# EAGLE design Mag_Read_STM_IN (EAGLE 6.6.0)

## Sheet 1 of 3
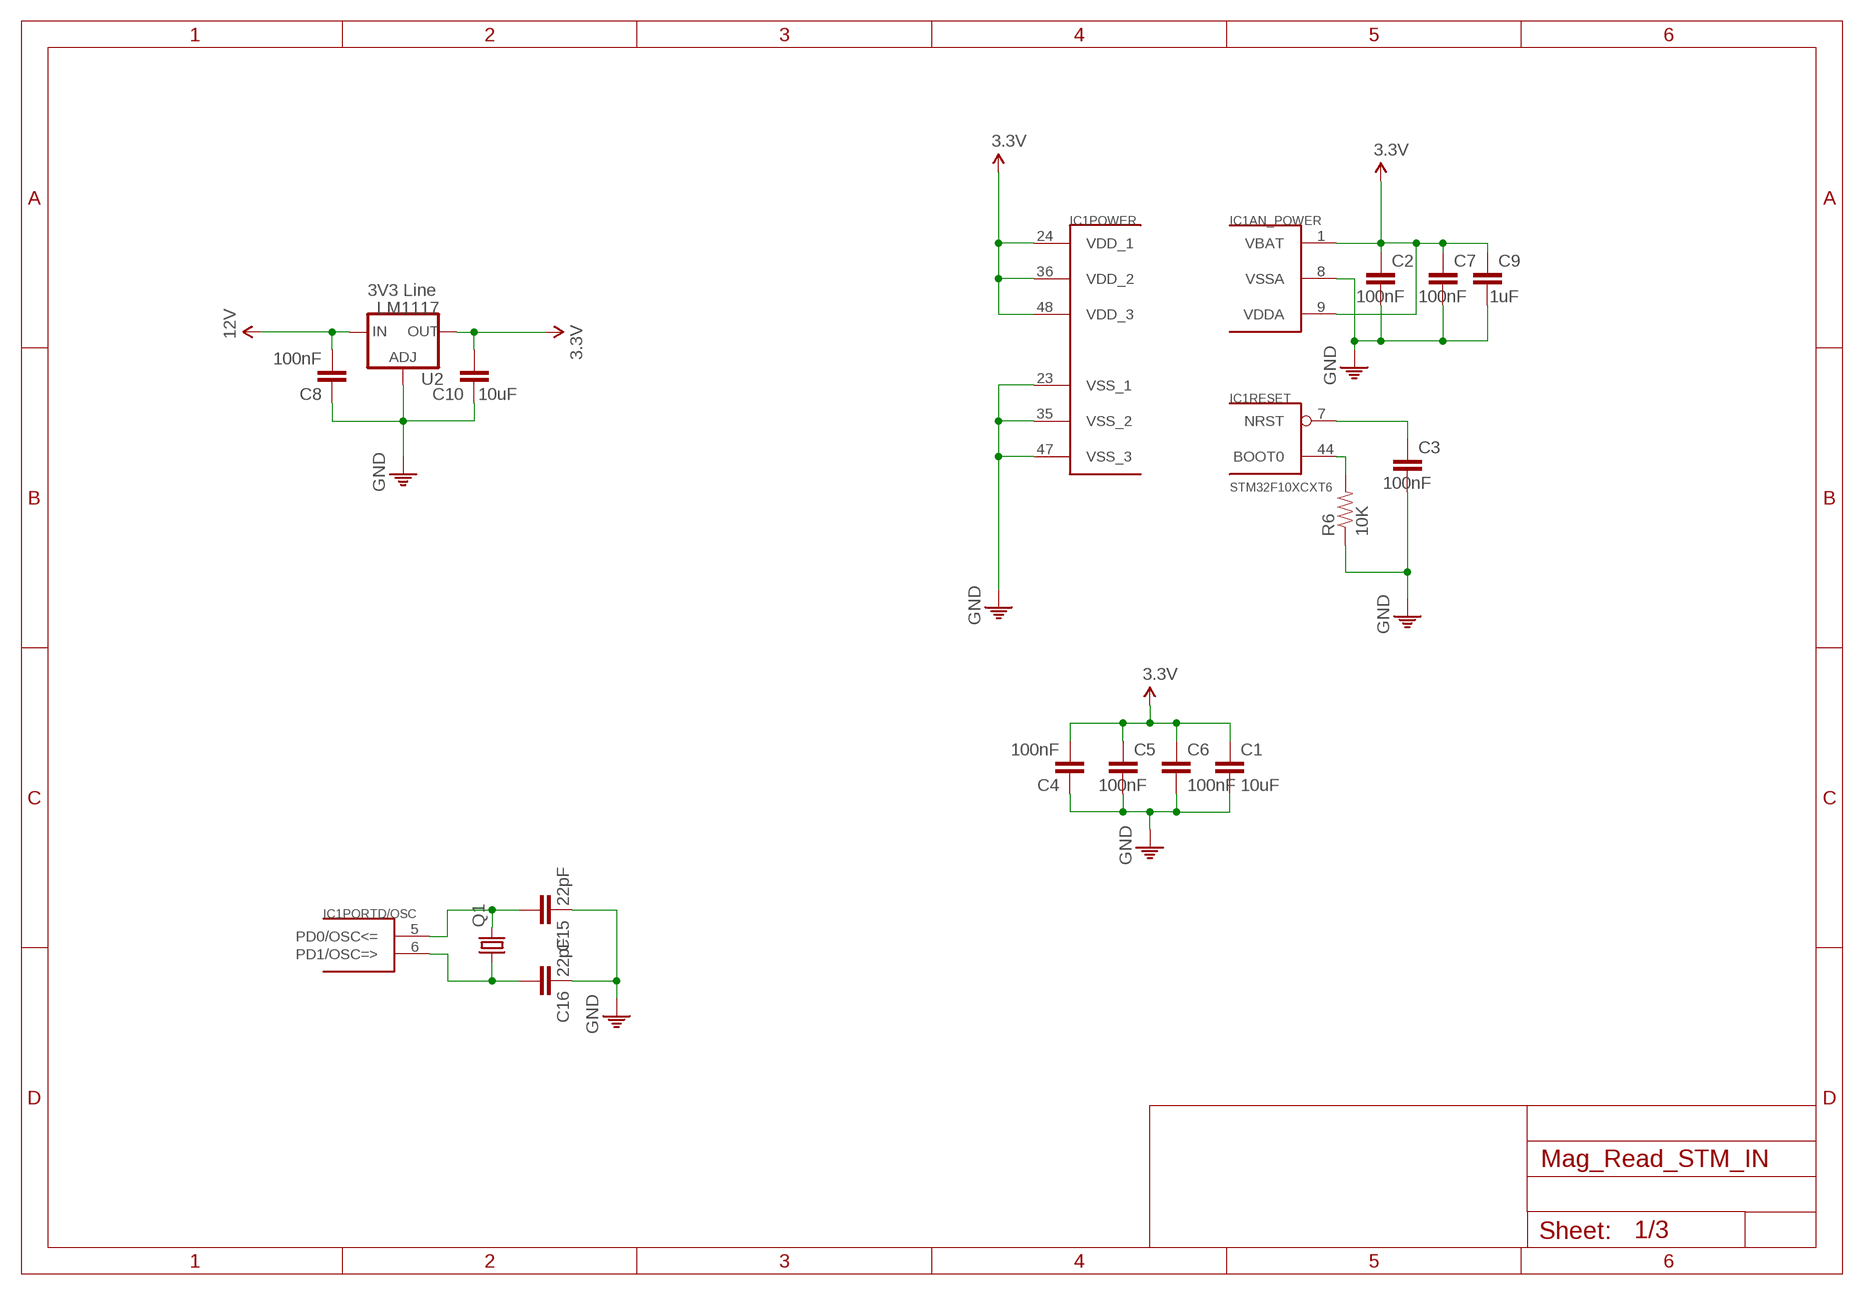
[diagram p0: schematic, sheet 1]

### Parts
C1  10uF  C-EUC0603  [C0603]
C2  100nF  C-EUC0603  [C0603]
C3  100nF  C-EUC0603  [C0603]
C4  100nF  C-EUC0603  [C0603]
C5  100nF  C-EUC0603  [C0603]
C6  100nF  C-EUC0603  [C0603]
C7  100nF  C-EUC0603  [C0603]
C8  100nF  C-EUC0603  [C0603]
C9  1uF  C-EUC0603  [C0603]
C10  10uF  C-EUC0603  [C0603]
C15  22pF  C-EUC0603  [C0603]
C16  22pF  C-EUC0603  [C0603]
IC1  STM32F10XCXT6  [TQFP48]
Q1  CRYSTALCTS406  [CTS406]
R6  10K  RESISTOR0603-RES  [0603-RES]
U2  LM1117  V_REG_317SMD  [SOT223]

### Nets
3.3V: C1.1 C2.1 C4.2 C5.1 C6.1 C7.1 C9.1 C10.2 IC1.1(AN_POWER:VBAT) IC1.9(AN_POWER:VDDA) IC1.24(POWER:VDD_1) IC1.36(POWER:VDD_2) IC1.48(POWER:VDD_3) U2.2(OUT) U2.4(OUT) ; also sheet 2,3
12V: C8.2 U2.3(IN) ; also sheet 3
GND: C1.2 C2.2 C3.2 C4.1 C5.2 C6.2 C7.2 C8.1 C9.2 C10.1 C15.1 C16.1 IC1.8(AN_POWER:VSSA) IC1.23(POWER:VSS_1) IC1.35(POWER:VSS_2) IC1.47(POWER:VSS_3) R6.1 U2.1(ADJ) ; also sheet 2,3
N$1: C15.2 IC1.5(PORTD/OSC:PD0/OSC<=) Q1.3
N$4: C16.2 IC1.6(PORTD/OSC:PD1/OSC=>) Q1.1
N$13: IC1.44(RESET:BOOT0) R6.2
NRST: C3.1 IC1.7(RESET:NRST) ; also sheet 3

### Notes on the sheet
- 3V3 Line

## Sheet 2 of 3
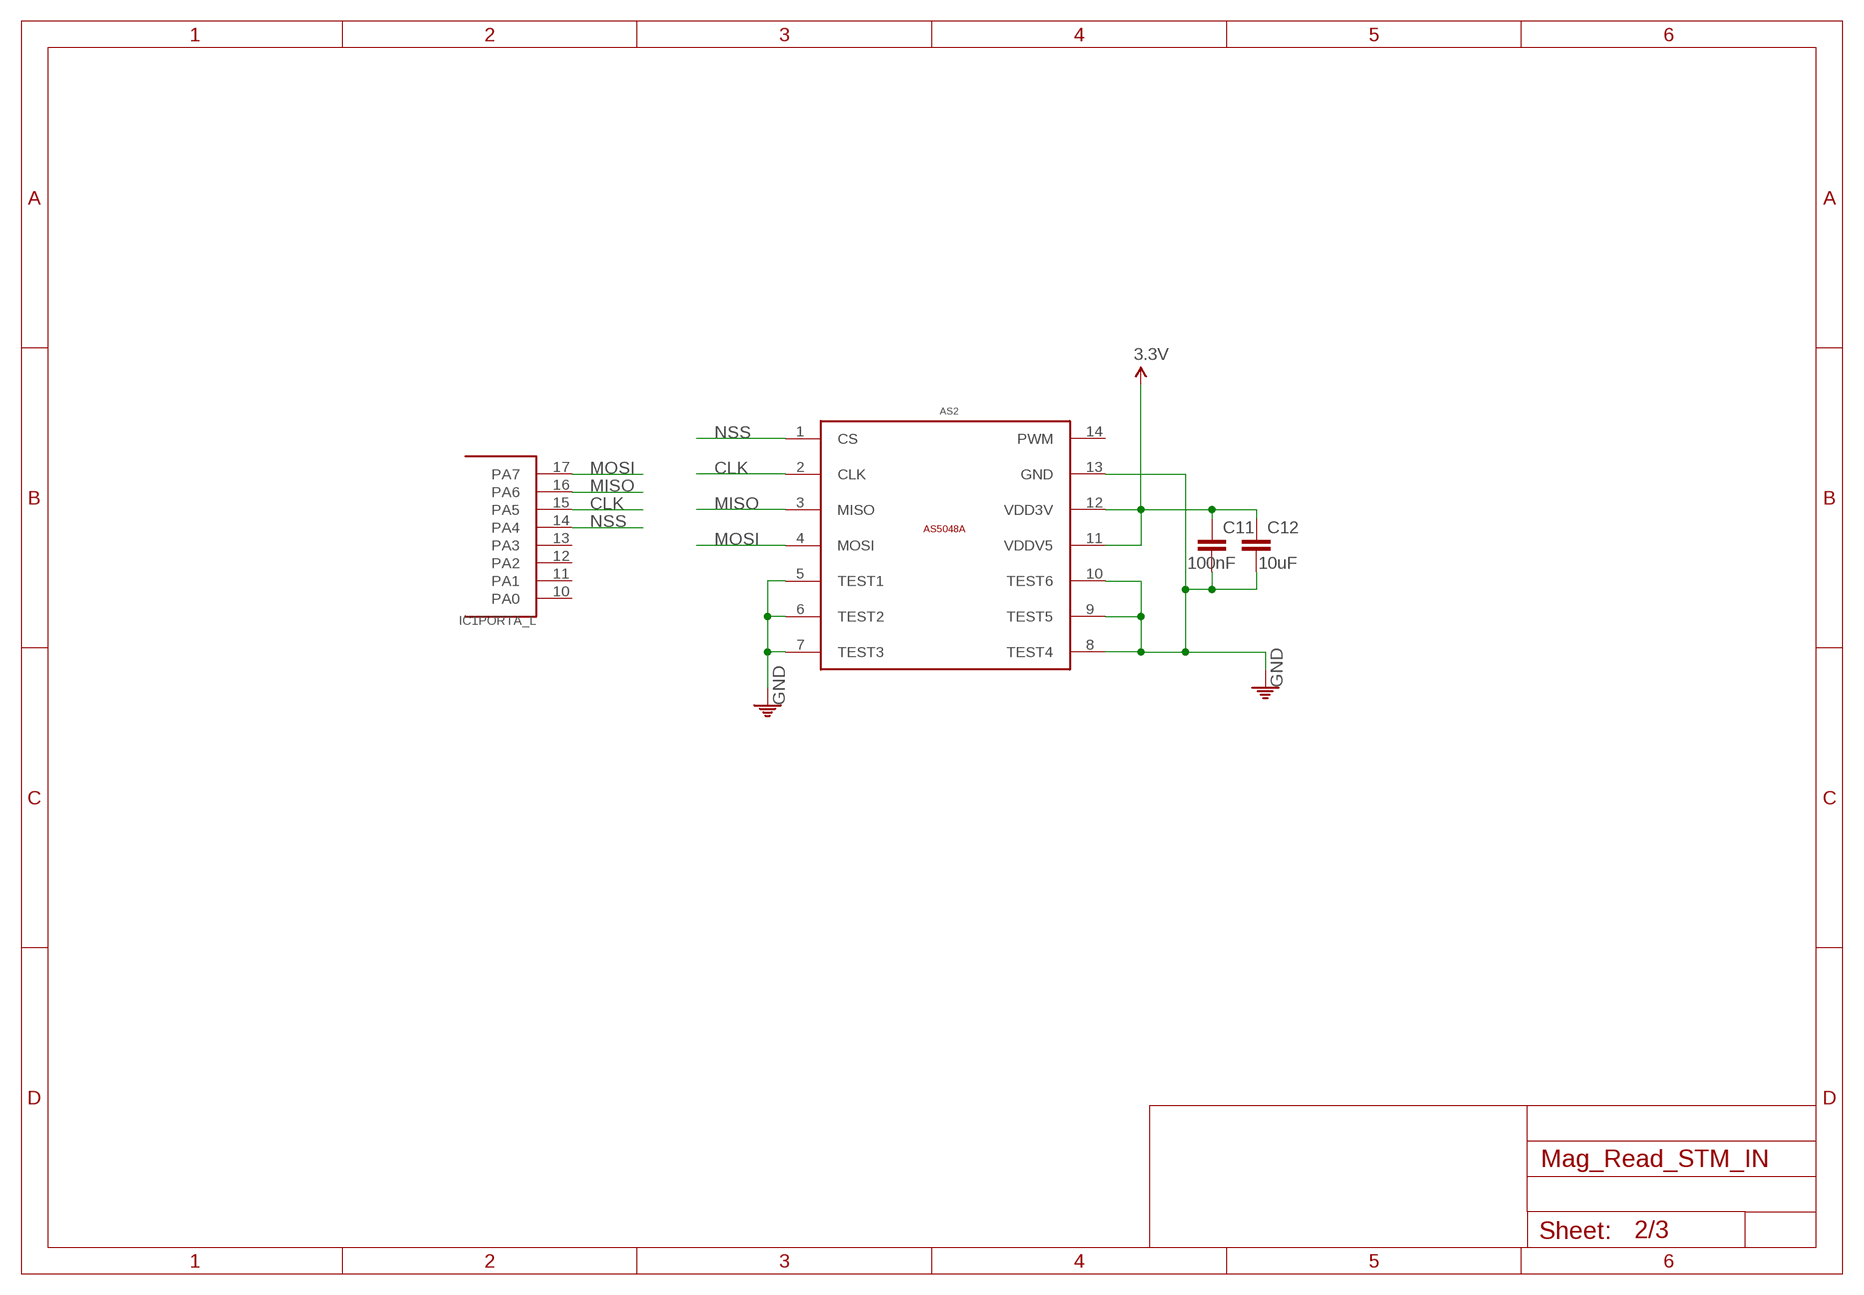
[diagram p1: schematic, sheet 2]

### Parts
AS2  AS5048A_MAGNETIC_ROTARY_ENCODERTSSOP14  [AS5048A_14-TSSOP]
C11  100nF  C-EUC0603  [C0603]
C12  10uF  C-EUC0603  [C0603]

### Nets
3.3V: AS2.11(VDDV5) AS2.12(VDD3V) C11.1 C12.1 ; also sheet 1,3
CLK: AS2.2(CLK) IC1.15(PORTA_L:PA5)
GND: AS2.5(TEST1) AS2.6(TEST2) AS2.7(TEST3) AS2.8(TEST4) AS2.9(TEST5) AS2.10(TEST6) AS2.13(GND) C11.2 C12.2 ; also sheet 1,3
MISO: AS2.3(MISO) IC1.16(PORTA_L:PA6)
MOSI: AS2.4(MOSI) IC1.17(PORTA_L:PA7)
NSS: AS2.1(CS) IC1.14(PORTA_L:PA4)
Unconnected: AS2.14(PWM) IC1.10(PORTA_L:PA0) IC1.11(PORTA_L:PA1) IC1.12(PORTA_L:PA2) IC1.13(PORTA_L:PA3)

### Notes on the sheet
- NSS
- MOSI | CLK
- MISO
- CLK | MISO
- NSS
- MOSI

## Sheet 3 of 3
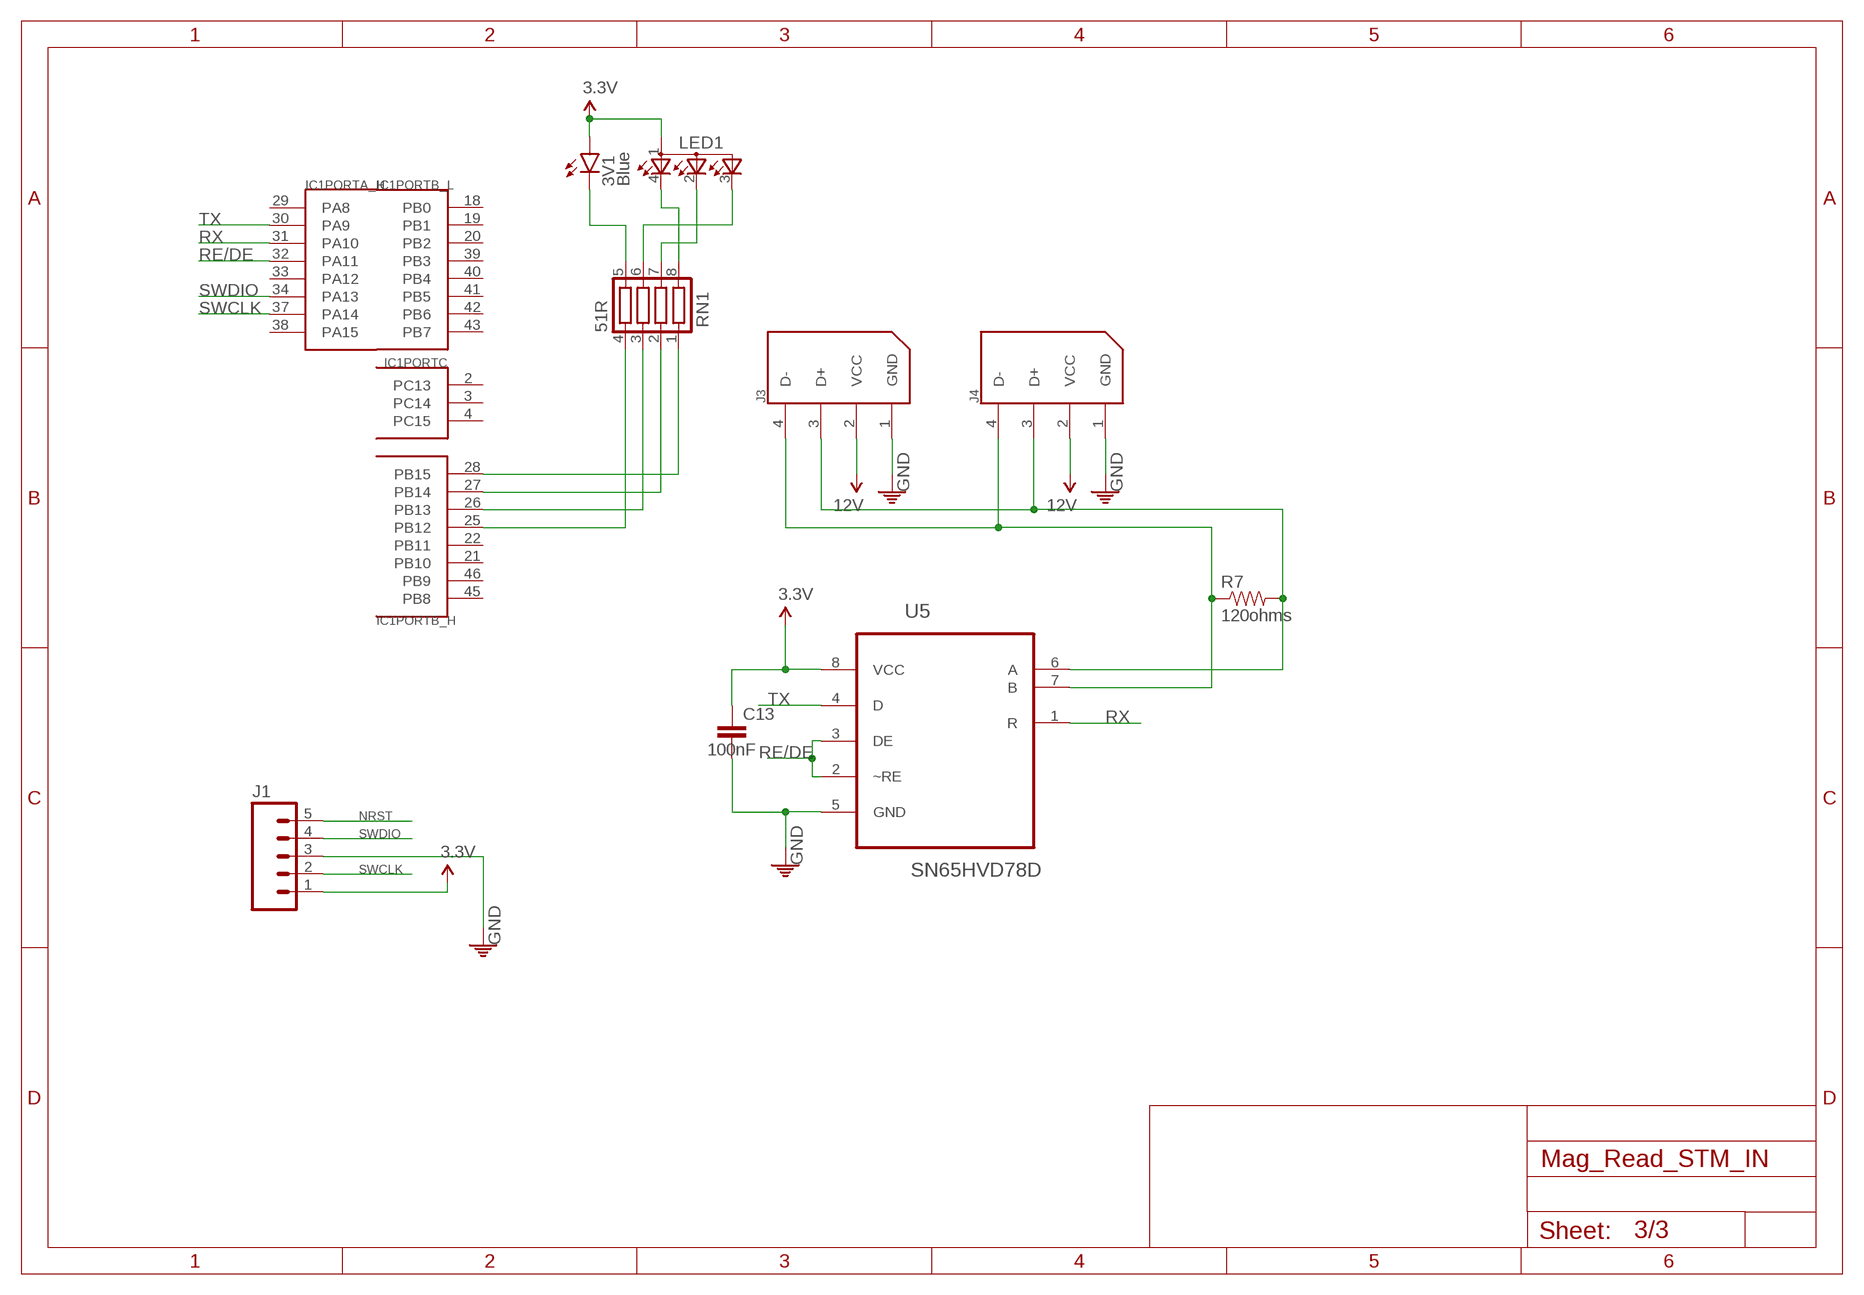
[diagram p2: schematic, sheet 3]

### Parts
3V1  Blue  LED0603  [LED-0603]
C13  100nF  C-EUC0603  [C0603]
J1  M05PTH  [1X05]
J3  22-03-5045  [5267-4]
J4  22-03-5045  [5267-4]
LED1  TOPLED-3  [P-LCC-4-3]
R7  120ohms  RESISTOR0603-RES  [0603-RES]
RN1  51R  CAY10-XXXJ  [CAY10-XXXJ4]
U5  SN65HVD78D  SN75176BD  [SOIC127P600X175-8N]

### Nets
3.3V: 3V1.A C13.1 J1.1 LED1.1(A2) U5.8(VCC) ; also sheet 1,2
12V: J3.2(VCC) J4.2(VCC) ; also sheet 1
D+ [diff.pairs]: J3.3(D+) J4.3(D+) R7.2 U5.6(A)
D- [diff.pairs]: J3.4(D-) J4.4(D-) R7.1 U5.7(B)
GND: C13.2 J1.3 J3.1(GND) J4.1(GND) U5.5(GND) ; also sheet 1,2
N$3: 3V1.C RN1.5
N$5: IC1.28(PORTB_H:PB15) RN1.1
N$6: IC1.27(PORTB_H:PB14) RN1.2
N$7: IC1.26(PORTB_H:PB13) RN1.3
N$8: LED1.3(CGREEN) RN1.6
N$9: LED1.2(CBLUE) RN1.7
N$10: LED1.4(CRED) RN1.8
N$16: IC1.25(PORTB_H:PB12) RN1.4
NRST: J1.5 ; also sheet 1
RE/DE: IC1.32(PORTA_H:PA11) U5.2(~RE) U5.3(DE)
RX: IC1.31(PORTA_H:PA10) U5.1(R)
SWCLK: IC1.37(PORTA_H:PA14) J1.2
SWDIO: IC1.34(PORTA_H:PA13) J1.4
TX: IC1.30(PORTA_H:PA9) U5.4(D)
Unconnected: IC1.2(PORTC:PC13) IC1.3(PORTC:PC14) IC1.4(PORTC:PC15) IC1.18(PORTB_L:PB0) IC1.19(PORTB_L:PB1) IC1.20(PORTB_L:PB2) IC1.21(PORTB_H:PB10) IC1.22(PORTB_H:PB11) IC1.29(PORTA_H:PA8) IC1.33(PORTA_H:PA12) IC1.38(PORTA_H:PA15) IC1.39(PORTB_L:PB3) IC1.40(PORTB_L:PB4) IC1.41(PORTB_L:PB5) IC1.42(PORTB_L:PB6) IC1.43(PORTB_L:PB7) IC1.45(PORTB_H:PB8) IC1.46(PORTB_H:PB9)

### Notes on the sheet
- TX
- RX
- RE/DE
- SWDIO
- SWCLK
- TX
- RX
- RE/DE
- NRST
- SWDIO
- SWCLK

## Library data of the parts
3V1 = SparkFun-LED:LED: LEDs Standard schematic elements and footprints for 5mm, 3mm, 1206, and 0603 sized LEDs. 5mm - Spark Fun Electronics SKU : COM-00529 (and others)
AS2 = xl_custom_lib:AS5048A_MAGNETIC_ROTARY_ENCODER: Austria Micro Systems Magnetic Rotary Encoder (14-bit Abgular Position Sensor) MFG PART #: AS5048A / AS5048A-HTSP-500 Interface: (SPI) Package: 14-TSSOP
C1-C13 C15 C16 = rcl:C-EU: CAPACITOR, European symbol
IC1 = stm32:STM32F10XCXT6: ST STM32F101/103 48pin LQFP
J1 = SparkFun-Connectors:M05: Header 5 Standard 5-pin 0.1" header. Use with straight break away headers (SKU : PRT-00116), right angle break away headers (PRT-00553), swiss pins (PRT-00743), machine pins (PRT-00117), and female headers (PRT-00115). Molex polarized connector foot print use with SKU : PRT-08230 with associated crimp pins and housings.
J3 J4 = molex-1:22-03-5045: Molex SPOX Vert, Tin (Dynamixel RX Bus) tested: YES (arbotix2)
LED1 = led:TOPLED-3: OSRAM - Hyper Multi TOPLED® (RGB) LB E673, LV E673, LT E673 - Power TOPLED® Enhanced optical Power LED (HOP2000) LS E67B, LA E67B, LO E67B, LY E67B - Hyper Multi TOPLED® Enhanced optical Power LED (HOP2000 / ATON®) LATB T66B - Hyper Multi TOPLED® Hyper-Bright LED LATB T686 Source: http://www.osram.convergy.de/
Q1 = crystal:CRYSTAL: CRYSTAL; OC_FARNELL: unknown; OC_NEWARK: unknown
R6 R7 = SparkFun-Passives:RESISTOR: Resistor Basic schematic elements and footprints for 0603, 1206, and PTH resistors.
RN1 = Robocup:CAY10-XXXJ
U2 = SparkFun-PowerIC:V_REG_317: Voltage Regulator Standard LM317 adjustable voltage regulator. AOI (Adjust Output Input). Google 'LM317 Calculator' for easy to use app to get the two resistor values needed. 240/720 for 5V output. 240/390 for 3.3V output. Spark Fun Electronics SKU : COM-00527
U5 = Robocup:SN75176BD: DIFFERENTIAL BUS TRANSCEIVER; MPN: SN75176BD; OC_FARNELL: 1103176; OC_NEWARK: 08F8127; PACKAGE: SOIC-8; SUPPLIER: Texas Instruments

## Net classes
0 default: clearance 0.205 mm
1 diff.pairs: width 0.254 mm, clearance 0.205 mm to class 0, clearance 0.318 mm

## Board
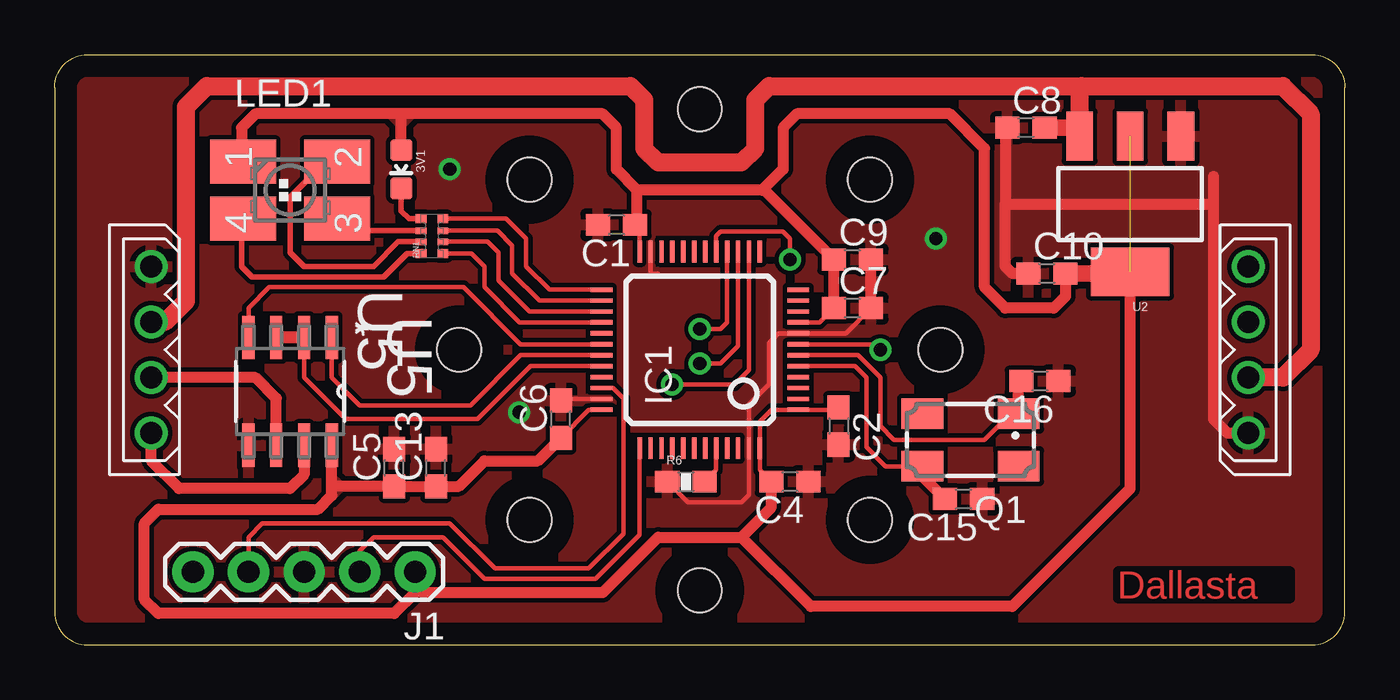
[diagram p3: board, top side]
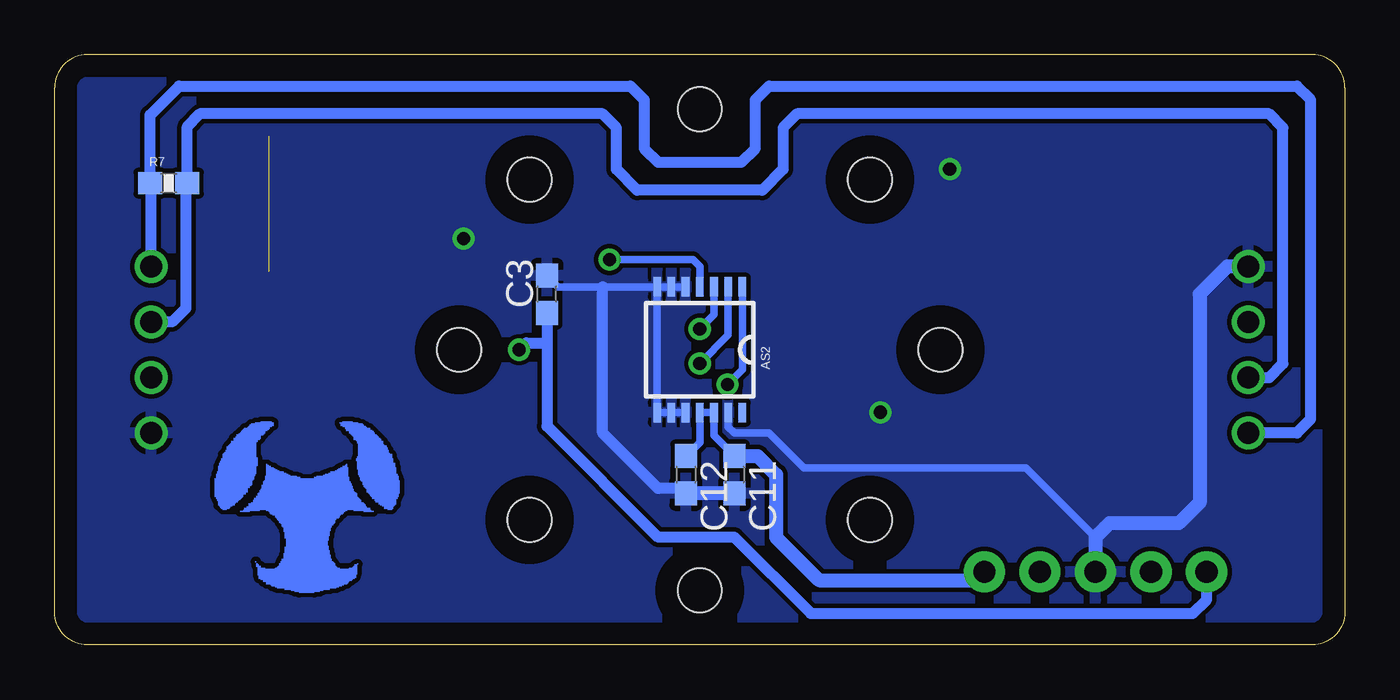
[diagram p4: board, bottom side, seen from below]

Size 59 x 27 mm. Coordinates in mm from the lower left corner, seen from the top.
Outline: 0,25.5 0,1.5 arc90 1.5,0 57.5,0 arc90 59,1.5 59,25.5 arc90 57.5,27 1.5,27 arc90 0,25.5
Copper layers (1*16): Top 0.035mm / dielectric 1.5mm / Bottom 0.035mm
Design rules "default *": minimum track width 8mil, minimum drill 23mil, track to track 8mil, track to pad 8mil, pad to pad 8mil, via to via 8mil, smd to smd 8mil, copper to edge 40mil, drill to drill 8mil, minimum pad ring 10mil, minimum via ring 8mil, stop-mask expansion 4mil, vias tented up to drill 0mil, thermal gap 10mil
Holes 2 mm at 29.5,24.5 18.5,13.5 29.5,2.5 21.72,5.72 37.28,21.28 37.28,5.72 40.5,13.5 21.72,21.28
tRestrict: area 25.4,24 to 26.3,24.9; area 27,25.2 to 27.9,26.2; area 32.7,24 to 33.6,24.9; area 31.1,25.2 to 32,26.2; area -1.3,-1.1 to 0.6,0.5; area 58.7,-1.1 to 60.3,0.5; area 58.7,26.5 to 60.6,28.1; area -1.3,26.5 to 0.3,28.1
bRestrict: area -1.3,-1.1 to 0.3,0.5; area 58.7,-1.1 to 60.3,0.5; area 58.7,26.5 to 60.3,28.1; area -1.3,26.5 to 0.3,28.1; area 1.9,24 to 3.5,25.2; area 25.2,23.8 to 26.6,25.1; area 27,25.2 to 27.9,26.2; area 26,21.1 to 27.6,22.4; area 27.3,22.4 to 28.2,23.3; area 30.8,22.4 to 31.7,23.3; area 31.4,21.1 to 33,22.7; area 31.1,25.2 to 32,26.2; 1 more areas

### Footprints (pad centres in the part's own frame; a part is rotated, then mirrored left to right if it is on the bottom)
LED-0603 = smd 1 x 1: A 0,-0.877; C 0,0.877
AS5048A_14-TSSOP = smd 0.9 x 0.35: 1 -2.875,1.95; 2 -2.875,1.3; 3 -2.875,0.65; 4 -2.875,0; 5 -2.875,-0.65; 6 -2.875,-1.3; 7 -2.875,-1.95; 8 2.875,-1.95; 9 2.875,-1.3; 10 2.875,-0.65; 11 2.875,0; 12 2.875,0.65; 13 2.875,1.3; 14 2.875,1.95
C0603 = smd 1.1 x 1: 1 -0.85,0; 2 0.85,0
TQFP48 = smd 0.2 x 1: 1 -2.75,-4.5; 2 -2.25,-4.5; 3 -1.75,-4.5; 4 -1.25,-4.5; 5 -0.75,-4.5; 6 -0.25,-4.5; 7 0.25,-4.5; 8 0.75,-4.5; 9 1.25,-4.5; 10 1.75,-4.5; 11 2.25,-4.5; 12 2.75,-4.5; 25 2.75,4.5; 26 2.25,4.5; 27 1.75,4.5; 28 1.25,4.5; 29 0.75,4.5; 30 0.25,4.5; 31 -0.25,4.5; 32 -0.75,4.5; 33 -1.25,4.5; 34 -1.75,4.5; 35 -2.25,4.5; 36 -2.75,4.5 | smd 1 x 0.2: 13 4.5,-2.75; 14 4.5,-2.25; 15 4.5,-1.75; 16 4.5,-1.25; 17 4.5,-0.75; 18 4.5,-0.25; 19 4.5,0.25; 20 4.5,0.75; 21 4.5,1.25; 22 4.5,1.75; 23 4.5,2.25; 24 4.5,2.75; 37 -4.5,2.75; 38 -4.5,2.25; 39 -4.5,1.75; 40 -4.5,1.25; 41 -4.5,0.75; 42 -4.5,0.25; 43 -4.5,-0.25; 44 -4.5,-0.75; 45 -4.5,-1.25; 46 -4.5,-1.75; 47 -4.5,-2.25; 48 -4.5,-2.75
1X05 = drill 1.016 pad 1.88: 1 0,0; 2 2.54,0; 3 5.08,0; 4 7.62,0; 5 10.16,0
5267-4 = drill 1: 1 0,0; 2 -2.54,0; 3 -5.08,0; 4 -7.62,0
P-LCC-4-3 = smd 2 x 3: 1 -1.3,-2.15; 2 -1.3,2.15; 3 1.3,2.15; 4 1.3,-2.15
CTS406 = smd 1.9 x 1.4: 1 -2.2,-1.2; 2 2.2,-1.2; 3 2.2,1.2; 4 -2.2,1.2
0603-RES = smd 1.1 x 1: 1 -0.85,0; 2 0.85,0
CAY10-XXXJ4 = smd 0.4 x 0.5: 1 -0.05,0; 4 1.55,0; 5 1.55,1; 8 -0.05,1 | smd 0.3 x 0.5: 2 0.5,0; 3 1,0; 6 1,1; 7 0.5,1
SOT223 = smd 1.219 x 2.235: 1 -2.311,-3.099; 2 0,-3.099; 3 2.311,-3.099 | smd 3.6 x 2.2: 4 0,3.099
SOIC127P600X175-8N = smd 1.981 x 0.559: 1 -2.464,1.905; 2 -2.464,0.635; 3 -2.464,-0.635; 4 -2.464,-1.905; 5 2.464,-1.905; 6 2.464,-0.635; 7 2.464,0.635; 8 2.464,1.905

### Placement (x,y rotation side)
3V1  15.85,21.76 180 top
AS2  29.5,13.5 270 bottom
C1  25.69,19.21 180 top
C2  35.85,10.01 270 top
C3  36.48,16.04 90 bottom
C4  33.63,7.47 180 top
C5  15.53,8.1 90 top
C6  23.15,10.32 90 top
C7  36.48,15.4 0 top
C8  44.42,23.66 0 top
C9  36.48,17.63 0 top
C10  45.38,16.99 0 top
C11  27.91,7.79 270 bottom
C12  30.14,7.79 270 bottom
C13  17.44,8.1 90 top
C15  41.56,6.67 180 top
C16  45.06,12.07 180 top
IC1  29.5,13.5 90 top
J1  16.48,3.34 180 top
J3  4.42,17.31 90 top
J4  54.58,9.69 270 top
LED1  10.77,20.8 270 top
Q1  41.88,9.37 180 top
R6  28.86,7.47 0 top
R7  53.79,21.12 0 bottom
RN1  17.75,17.95 90 top
U2  49.19,20.17 180 top
U5  10.77,11.6 270 top

### Tracks (layer width: path | path; a pad name or v marks a point on that pad's centre or on a via)
3.3V  (1 unrouted)
  Top 0.203: C6.1 24.43,10.75 IC1.36 | C4.2 32.25,8 IC1.48 32.25,10.22 32.78,10.75 IC1.1 35.74,10.75 C2.1 | IC1.9 34.98,14.75 C7.1 | IC1.24 26.75,19 C1.1
  Top 0.508: C10.2 46.23,15.94 45.69,15.4 43.47,15.4 42.52,16.36 42.52,22.71 40.93,24.3 33.95,24.3 33.31,23.66 33.31,21.76 32.52,20.96 | 32.52,20.96 32.36,20.8 26.64,20.8 | 26.64,20.8 25.69,21.76 25.69,23.66 25.05,24.3 15.85,24.3 | C1.1 26.64,19.32 26.64,20.8 | C7.1 C9.1 32.52,20.75 32.52,20.96 | 31.41,4.93 27.59,4.93 25.05,2.39 16.8,2.39 16.48,2.71 | 12.67,7.15 12.67,6.83 12.04,6.2 4.73,6.2 4.1,5.56 4.1,2.07 4.73,1.44 15.53,1.44 16.48,2.39 16.48,2.71 | 12.67,7.15 U5.8 | 22.95,9.27 C6.1 22.09,8.42 19.66,8.42 18.49,7.25 C13.1 C5.1 12.77,7.25 arc90 12.67,7.15 | 31.41,4.93 32.78,6.3 C4.2 | U2.4 49.19,7.15 43.79,1.75 34.58,1.75 31.41,4.93 | J1.1 16.48,2.71 | 15.85,24.3 9.18,24.3 8.55,23.66 8.55,22.18 LED1.1 | 3V1.A 15.85,24.3
  Top 0.762: C10.2 49.11,16.99 U2.4
  Bottom 0.343: C11.1 28.85,9.57 AS2.12 AS2.11 29.5,9.27 C12.1
  Bottom 0.635: C11.1 26.86,8.63 26.01,7.79 26.01,4.93 24.04,2.96 16.87,2.96 J1.1
  pour Top: 15.85,23.66 15.21,24.3 16.48,24.3
  pour Top: 13.31,7.31 12.67,7.94 12.67,6.67 12.67,6.51 13.31,7.15
12V
  Top 0.762: C8.2 46.48,23.66 U2.3
  Top 0.826: 46.96,25.56 32.67,25.56 32.04,24.93 32.04,22.71 31.41,22.07 27.59,22.07 26.96,22.71 26.96,24.93 26.32,25.56 6.96,25.56 6,24.61 6,15.72 5.05,14.77 J3.2 | 46.96,25.56 56.17,25.56 57.44,24.3 57.44,13.5 56.17,12.23 J4.2 | U2.3 46.87,25.48 46.96,25.56
CLK  (via drill 0.6)
  Top 0.203: v29.5,12.87 30.45,12.87 31.25,13.66 IC1.15
  Bottom 0.343: AS2.2 28.2,14.16 v29.5,12.87
D+
  Top 0.508: U5.6 10.13,11.28 9.18,12.23 J3.3
  Bottom 0.508: J3.3 3.46,12.23 2.83,12.87 2.83,23.66 3.46,24.3 25.05,24.3 25.69,23.66 25.69,21.76 26.64,20.8 32.36,20.8 33.31,21.76 33.31,23.66 33.95,24.3 52.36,24.3 52.94,23.72 R7.2 53,21.06 53,15.4 53.63,14.77 J4.3
D-
  Top 0.508: U5.7 11.4,7.79 10.77,7.15 5.69,7.15 4.42,8.42 J3.4
  Bottom 0.508: J3.4 2.2,9.69 1.56,10.32 1.56,24.93 2.2,25.56 26.32,25.56 26.96,24.93 26.96,22.71 27.59,22.07 31.41,22.07 32.04,22.71 32.04,24.93 32.67,25.56 53.31,25.56 54.64,24.24 R7.1 54.58,21.06 J4.4
GND  (via drill 0.6)
  Top 0.203: IC1.35 23.23,11.25 C6.2 | C7.2 36.18,14.25 IC1.8 33.11,14.25 32.67,13.82 32.67,11.91 31.75,10.99 IC1.47 31.75,6.86 31.41,6.51 28.97,6.51 R6.1 | IC1.23 27.25,16.99 27.59,16.99
  Top 0.508: U2.1 51.5,22.94 | 53,21.44 53,20.17 | 53,20.17 53,10.32 53.63,9.69 J4.1 | C10.1 43.79,16.99 43.47,17.31 43.47,20.17 | C8.1 43.47,23.56 43.47,20.17 | 43.47,20.17 53,20.17 | C7.2 C9.2
  Bottom 0.343: AS2.10 AS2.9 AS2.8 AS2.7 | AS2.5 AS2.6 AS2.7 | AS2.13 28.2,9.98 27.91,9.69 26.32,9.69 24.74,8.1 14.58,8.1 11.4,4.93 | AS2.7 33.95,16.38 35.97,16.38 C3.2
  Bottom 0.508: C11.2 29.92,6.93 30.14,7.15 31.41,7.15 33.95,9.69 33.95,16.38
  Bottom 0.635: J3.1 5.37,17.31 6.64,16.04 6.64,6.51 7.59,5.56 10.77,5.56 11.4,4.93 J1.3 | C11.2 C12.2
  other vias: 21.24,10.64 40.3,18.58 18.07,21.76
  pour Bottom: -0.98,27.79 59.98,27.79 59.98,-0.79 -0.98,-0.79
  pour Top (rank 6): -0.98,27.79 59.98,27.79 59.98,-0.79 -0.98,-0.79
MISO  (via drill 0.6)
  Top 0.203: v29.5,14.45 30.45,14.45 30.75,14.75 IC1.16
  Bottom 0.343: AS2.3 28.85,15.1 v29.5,14.45
MOSI  (via drill 0.6)
  Top 0.203: v33.63,17.63 33.63,18.58 33.31,18.9 30.45,18.9 30.25,18.7 IC1.17
  Bottom 0.343: AS2.4 29.5,17.31 29.82,17.63 v33.63,17.63
N$1
  Top 0.203: Q1.3 38,8.17 37.12,9.05 37.12,10.64 37.12,10.96 37.12,12.23 36.6,12.75 IC1.5
  Top 0.508: C15.2 39.68,7.71 Q1.3
N$3
  Top 0.254: RN1.5 16.2,19.5 15.85,19.85 3V1.C
N$4
  Top 0.203: IC1.6 36.73,13.25 37.76,12.23 37.76,10.01 38.39,9.37 42.52,9.37 43.47,10.32 43.84,10.32 Q1.1
  Top 0.508: Q1.1 44.08,12.11 C16.2
N$5
  Top 0.203: IC1.28 21.27,14.75 19.66,16.36 19.66,17.31 19.07,17.89 RN1.1
N$6
  Top 0.203: IC1.27 21.72,15.25 20.29,16.68 20.29,17.95 19.79,18.45 RN1.2
N$7
  Top 0.203: IC1.26 22.17,15.75 20.93,16.99 20.93,18.26 20.24,18.95 RN1.3
N$8
  Top 0.254: RN1.6 13.48,18.95 LED1.3
N$9
  Top 0.254: RN1.7 15.71,18.45 14.58,17.31 11.4,17.31 10.77,17.95 10.77,20.48 12.04,21.76 12.57,21.76 LED1.2
N$10
  Top 0.254: RN1.8 16.12,17.89 15.05,16.83 9.02,16.83 8.55,17.31 8.55,19.43 LED1.4
N$13
  Top 0.203: IC1.44 30.25,8 R6.2
N$16
  Top 0.203: IC1.25 22.62,16.25 21.56,17.31 21.56,18.58 20.65,19.5 RN1.4
NRST  (via drill 0.6)
  Top 0.203: IC1.7 37.51,13.75 v37.76,13.5
  Bottom 0.508: C3.1 36.48,13.82 | 36.48,13.82 36.48,10.01 31.41,4.93 27.91,4.93 24.42,1.44 6.96,1.44 6.32,2.07 J1.5 | v37.76,13.5 37.44,13.82 36.48,13.82
NSS  (via drill 0.6)
  Top 0.203: v28.23,11.91 31.09,11.91 31.75,12.57 IC1.14
  Bottom 0.343: AS2.1 27.55,12.59 v28.23,11.91
RE/DE
  Top 0.203: IC1.32 21.77,12.75 19.34,10.32 13.31,10.32 11.4,12.23 U5.2
  Top 0.559: U5.2 U5.3
RX
  Top 0.203: IC1.31 21.31,13.25 19.02,10.96 13.94,10.96 12.67,12.23 U5.1
SWCLK
  Top 0.203: IC1.37 26.75,5.04 24.74,3.02 19.66,3.02 17.75,4.93 14.58,4.93 13.94,4.29 J1.2
SWDIO
  Top 0.203: IC1.34 25.54,11.75 26.01,11.28 26.01,5.09 24.42,3.5 20.13,3.5 18.07,5.56 9.5,5.56 8.86,4.93 J1.4
TX
  Top 0.203: IC1.30 21.31,13.75 18.7,16.36 9.82,16.36 8.86,15.4 U5.4
(copper drawn outside any net)
  shapes: Bottom area x308

### Text on the board
Top: Dallasta